# Altium schematic sheet Battery-Indicator.SchDoc
size A; SheetNumber: 3; SheetTotal: 5
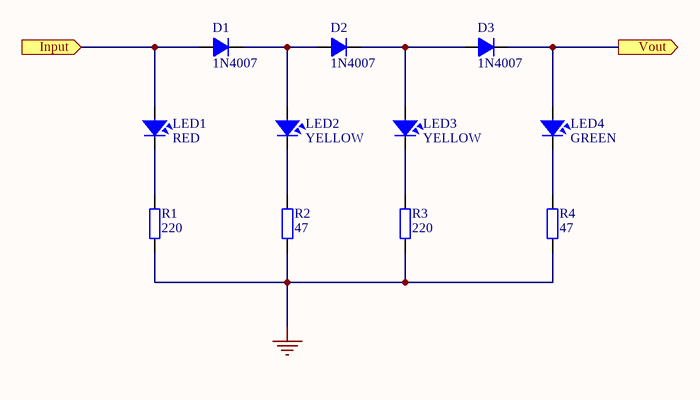
[diagram p0: Battery-Indicator.SchDoc]

## Parts
D1  1N4007  [D1A]
D2  1N4007  [D1A]
D3  1N4007  [D1A]
LED1  RED  [LED-3]
LED2  YELLOW  [LED-3]
LED3  YELLOW  [LED-3]
LED4  GREEN  [LED-3]
R1  220  [RES_0805]
R2  47  [RES_0805]
R3  220  [RES_0805]
R4  47  [RES_0805]

## Ports
Input (in), Vout (out)

## Nets
GND: R1.1 R2.1 R3.1 R4.1
Input: D1.1(A) LED1.1 ; port Input
Vout: D3.2(K) LED4.1 ; port Vout
NetD1_2: D1.2(K) D2.1(A) LED2.1
NetD2_2: D2.2(K) D3.1(A) LED3.1
NetLED1_2: LED1.2 R1.2
NetLED2_2: LED2.2 R2.2
NetLED3_2: LED3.2 R3.2
NetLED4_2: LED4.2 R4.2

## Library data of the parts
D1-D3 = D1A: Diode 1A; Value: 1N4007
LED1-LED4 = LED: LED Single colour Green and Red; Value: LED 3 ly Single Colour
R1-R4 = RES_0805: Resistor SMD 0805; Manufacturer: *; Manufacturer Part Number: *; Distributor Link: *; LCSC: *